# Altium schematic sheet Sheet1.SchDoc
size A4
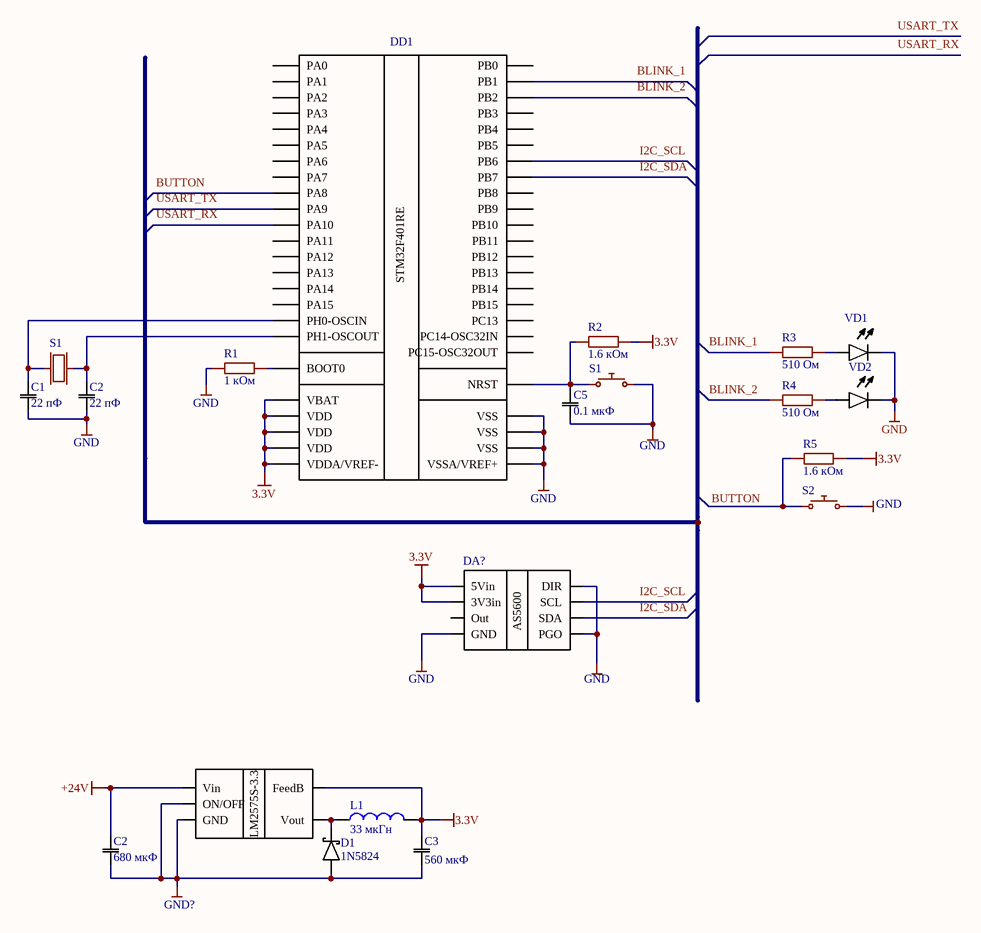
[diagram p0: Sheet1.SchDoc]

## Parts
(Parts that share a designator on the sheet are numbered #1, #2 ... from top to bottom, then left to right.)
*  LM2575  (value not drawn)
C1  22 пФ
C2#1  22 пФ
C2#2  680 мкФ
C3  560 мкФ
C5  0.1 мкФ
D1  1N5824
DA?  AS5600  (value not drawn)
DD1  STM32F401R  [F401RE]  (value not drawn)
GND#1  GND  (value not drawn)
GND#2  GND  (value not drawn)
GND#3  GND  (value not drawn)
GND#4  GND  (value not drawn)
GND#5  GND  (value not drawn)
GND#6  (no value)
GND#7  GND  (value not drawn)
GND#8  GND  (value not drawn)
GND?  GND  (value not drawn)
L1  value 33 мкГн  (hidden comment: Inductor)
R1  1 кОм
R2  1.6 кОм
R3  510 Ом
R4  510 Ом
R5  1.6 кОм
S1#1  Кварц  (value not drawn)
S1#2  Button  (value not drawn)
S2  Button  (value not drawn)
VD1  LED  (value not drawn)
VD2  LED  (value not drawn)

## Nets
3.3V: *.?4(FeedB) C3.C?(Cond) DA?.?1(5Vin) DA?.?2(3V3in) DD1.?20(VBAT) DD1.?21(VDD) DD1.?22(VDD) DD1.?23(VDD) DD1.?24(VDDA/VREF-) L1.2 R2.?1 R5.?1
+24V: *.?1(Vin) C2#2.C?(Cond)
Net*_?2: *.?2(ON/OFF) *.?3(GND) C2#2.?1 C3.?1 D1.?2 GND?.?1
Net*_?5: *.?5(Vout) D1.?1 L1.1
NetC1_?1: C1.?1 C2#1.?1 GND#3.?1
NetC1_C?: C1.C?(Cond) DD1.?17(PH0-OSCIN) S1#1.Q?(Кварц)
NetC2#1_C?: C2#1.C?(Cond) DD1.?18(PH1-OSCOUT) S1#1.?1
NetC5_?1: C5.?1 GND#4.?1 S1#2.?1
NetC5_C?: C5.C?(Cond) DD1.?44(NRST) R2.?2 S1#2.?2
NetDA?_?4: DA?.?4(GND) GND#7.?1
NetDA?_?5: DA?.?5(DIR) DA?.?8(PGO) GND#8.?1
NetDD1_?19: DD1.?19(BOOT0) R1.?1
NetDD1_?45: DD1.?45(VSS) DD1.?46(VSS) DD1.?47(VSS) DD1.?48(VSSA/VREF+) GND#5.?1
NetGND#1_?1: GND#1.?1 R1.?2
NetGND#2_?1: GND#2.?1 VD1.?2 VD2.?2
NetGND#6_?1: GND#6.?1 S2.?1
NetR3_?1: R3.?1 VD1.?1
NetR4_?1: R4.?1 VD2.?1
NetR5_?2: R5.?2 S2.?2

Not connected (* = marked no-connect by the designer): DA? ?3(Out) ?6(SCL) ?7(SDA); DD1 ?1(PA0) ?2(PA1) ?3(PA2) ?4(PA3) ?5(PA4) ?6(PA5) ?7(PA6) ?8(PA7) ?9(PA8) ?10(PA9) ?11(PA10) ?12(PA11) ?13(PA12) ?14(PA13) ?15(PA14) ?16(PA15) ?25(PB0) ?26(PB1) ?27(PB2) ?28(PB3) ?29(PB4) ?30(PB5) ?31(PB6) ?32(PB7) ?33(PB8) ?34(PB9) ?35(PB10) ?36(PB11) ?37(PB12) ?38(PB13) ?39(PB14) ?40(PB15) ?41(PC13) ?42(PC14-OSC32IN) ?43(PC15-OSC32OUT); R3 ?2; R4 ?2

## Notes on the sheet
- USART_TX
- USART_RX
- BLINK_1
- BLINK_2
- BUTTON
- I2C_SDA
- I2C_SCL
- (near R3) BLINK_1
- (in symbol LM2575) LM2575S-3.3

## Library data of the parts
C1 C2#1 C2#2 C3 C5 = C?
D1 = Диод Шоттки
DD1 = STM32F401RE
GND#6 = GND
L1 = Inductor: SimulationGenericComponent: True
R1-R5 = RESISTOR
VD1 VD2 = LED: LED 5mm